# Altium project Triumvi_v9_batteryPack.PrjPcb
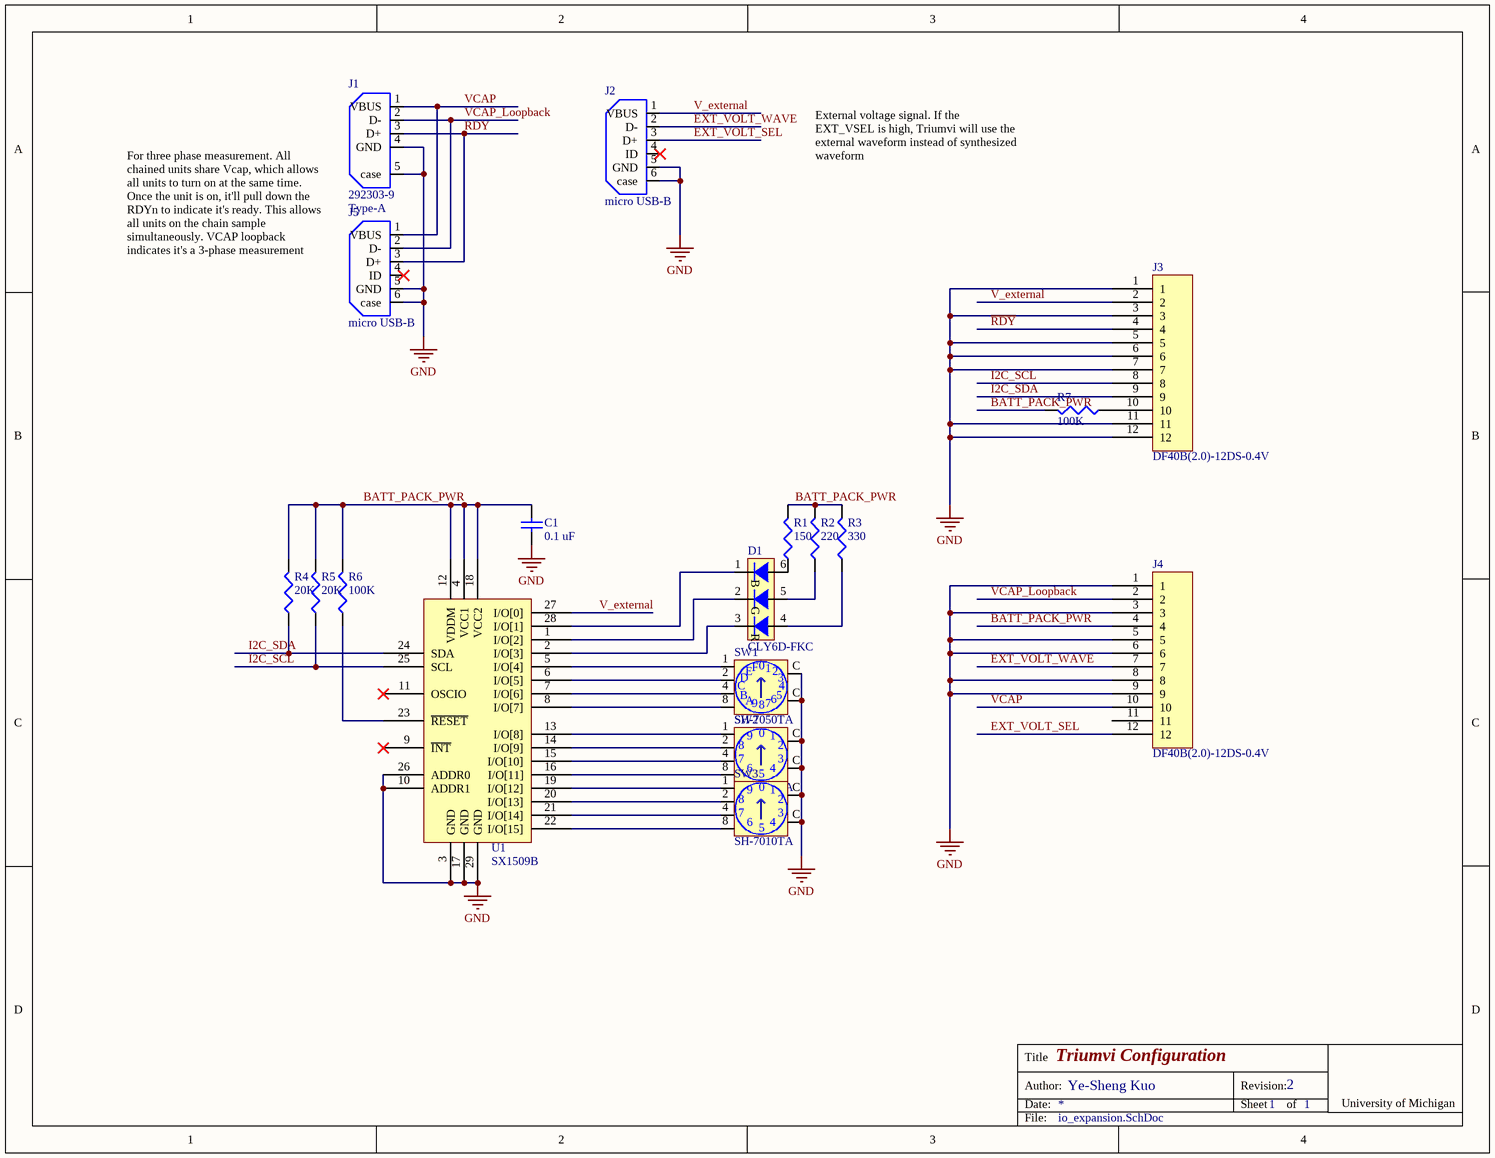
[diagram p0: io_expansion.SchDoc]
1 sheet, 18 parts. Net scope: global (net labels, ports and power ports of the same name join across sheets).
Board file: io_expansion_v9.PcbDoc

## Sheet io_expansion.SchDoc: Triumvi Configuration
size Letter; Author: Ye-Sheng Kuo; Revision: 2; SheetNumber: 1; SheetTotal: 1

### Parts
C1  value 0.1 uF  [0603]  (hidden comment: Ceramic capacitor)
D1  CLY6D-FKC  [PLCC6]
J1  292303-9  Type: Type-A  [292303-9]
J2  micro USB-B  [Micro USB-B]
J3  DF40B(2.0)-12DS-0.4V  [DF40B(2.0)-12DS-0.4V]
J4  DF40B(2.0)-12DS-0.4V  [DF40B(2.0)-12DS-0.4V]
J5  micro USB-B  [Micro USB-B]
R1  value 150  [0603]  (hidden comment: Chip resistor)
R2  value 220  [0603]  (hidden comment: Chip resistor)
R3  value 330  [0603]  (hidden comment: Chip resistor)
R4  value 20K  [0603]  (hidden comment: Chip resistor)
R5  value 20K  [0603]  (hidden comment: Chip resistor)
R6  value 100K  [0603]  (hidden comment: Chip resistor)
R7  value 100K  [0603]  (hidden comment: Chip resistor)
SW1  SH-7050TA  [SH-7050A]
SW2  SH-7010TA  [SH-7010A]
SW3  SH-7010TA  [SH-7010A]
U1  SX1509B  [QFN40P400X400X60_HS-29N]

### Nets
GND: C1.2 J1.4(GND) J1.5(case) J2.5(GND) J2.6(case) J3.1 J3.3 J3.5 J3.6 J3.7 J3.11 J3.12 J4.1 J4.3 J4.5 J4.6 J4.8 J4.9 J5.5(GND) J5.6(case) SW1.C SW2.C SW3.C U1.3(GND) U1.10(ADDR1) U1.17(GND) U1.26(ADDR0) U1.29(GND)
BATT_PACK_PWR: C1.1 J4.4 R1.1 R2.1 R3.1 R4.1 R5.1 R6.1 R7.1 U1.4(VCC1) U1.12(VDDM) U1.18(VCC2)
EXT_VOLT_SEL: J2.3(D+) J4.12
EXT_VOLT_WAVE: J2.2(D-) J4.7
I2C_SCL: J3.8 R5.2 U1.25(SCL)
I2C_SDA: J3.9 R4.2 U1.24(SDA)
~{RDY}: J1.3(D+) J3.4 J5.3(D+)
V_external: J2.1(VBUS) J3.2 U1.27(I/O[0])
VCAP: J1.1(VBUS) J4.10 J5.1(VBUS)
VCAP_Loopback: J1.2(D-) J4.2 J5.2(D-)
NetD1_1: D1.1 U1.28(I/O[1])
NetD1_2: D1.2 U1.1(I/O[2])
NetD1_3: D1.3 U1.2(I/O[3])
NetD1_4: D1.4 R3.2
NetD1_5: D1.5 R2.2
NetD1_6: D1.6 R1.2
NetJ3_10: J3.10 R7.2
NetR6_2: R6.2 U1.23(~{RESET})
NetSW1_1: SW1.1 U1.5(I/O[4])
NetSW1_2: SW1.2 U1.6(I/O[5])
NetSW1_4: SW1.4 U1.7(I/O[6])
NetSW1_8: SW1.8 U1.8(I/O[7])
NetSW2_1: SW2.1 U1.13(I/O[8])
NetSW2_2: SW2.2 U1.14(I/O[9])
NetSW2_4: SW2.4 U1.15(I/O[10])
NetSW2_8: SW2.8 U1.16(I/O[11])
NetSW3_1: SW3.1 U1.19(I/O[12])
NetSW3_2: SW3.2 U1.20(I/O[13])
NetSW3_4: SW3.4 U1.21(I/O[14])
NetSW3_8: SW3.8 U1.22(I/O[15])

Not connected (* = marked no-connect by the designer): J2 4(ID)*; J4 11; J5 4(ID)*; U1 9(~{INT})* 11(OSCIO)*

### Notes on the sheet
- External voltage signal. If the EXT_VSEL is high, Triumvi will use the external waveform instead of synthesized waveform
- For three phase measurement. All chained units share Vcap, which allows all units to turn on at the same time. Once the unit is on, it'll pull down the RDYn to indicate it's ready. This allows all units on the chain sample simultaneously. VCAP loopback indicates it's a 3-phase measurement
- Title
- Date:
- Author:
- Revision:
- Sheet
- of
- University of Michigan
- File:
- (in symbol D_CLY6D-FKC) B; G; R
- (in symbol SH-7010TA) 9; 0; 7; 3; 6; 5
- (in symbol SH-7050TA) F; 0; E; D; 3; B; 5; A; 6; 9; 7

### Library data of the parts
C1 = C_0.1u_25V_0603_ceramic: Ceramic capacitor, 0.1 uF, 0603 package; Manufacture: TDK; voltage rated: 25V; tolerance: 10%; package: 0603; Supplier 1: Digi-Key; Supplier Part Number 1: 445-1316-1-ND
D1 = D_CLY6D-FKC: CREE PLCC6 3 in 1 SMD LED; Supplier 1: Digi-Key; Supplier Part Number 1: CLY6D-FKC-CK1N1D1BB7D3D3CT-ND
J1 = 292303-9: USB 2.0 Type A; Supplier 1: Digi-Key; Supplier Part Number 1: A108853CT-ND
J2 J5 = Micro USB: CONN USB MICRO B RECPT SMT R/A; Supplier 1: Digi-Key; Supplier Part Number 1: 609-4616-1-ND
J3 J4 = DF40B(2.0)-12DS-0.4V: Hirose BM20 Series, 0.4mm pitch, 2mm stack height, 12 pos, header; Supplier 1: Digi-Key; Supplier Part Number 1: H124594CT-ND
R1 = R_150_0603: Chip resistor, 150,  0603 package; tolerance: 1%; power: 1/1 W; package: 0603; Supplier 1: Digi-Key; Supplier Part Number 1: 541-150HCT-ND
R2 = R_220_0603: Chip resistor, 220, 0603 package; tolerance: 1%; power: 1/10 W; package: 0603; Supplier 1: Digi-Key; Supplier Part Number 1: 541-220HCT-ND
R3 = R_330_0603: Chip resistor, 330, 0603 package; tolerance: 1%; power: 1/10 W; package: 0603; Supplier 1: Digi-Key; Supplier Part Number 1: 541-330HCT-ND
R4 R5 = R_20K_0603: Chip resistor, 20K, 0603 package; tolerance: 1%; power: 1/10 W; package: 0603; Supplier 1: Digi-Key; Supplier Part Number 1: 541-20.0KHCT-ND
R6 R7 = R_100K_0603: Chip resistor, 100K, 0603 package; tolerance: 1%; power: 1/10 W; package: 0603; Supplier 1: Digi-Key; Supplier Part Number 1: 541-100KHCT-ND
SW1 = SH-7050TA: ROTARY CODED SWITCHES; Supplier 1: Digi-Key; Supplier Part Number 1: 563-1213-2-ND
SW2 SW3 = SH-7010TA: ROTARY CODED SWITCHES; Supplier 1: Digi-Key; Supplier Part Number 1: 563-1207-1-ND
U1 = SX1509B: Voltage Level Shifting GPIO  with LED Driver and Keypad Engine; Supplier 1: Digi-Key; Supplier Part Number 1: SX1509BIULCT-ND